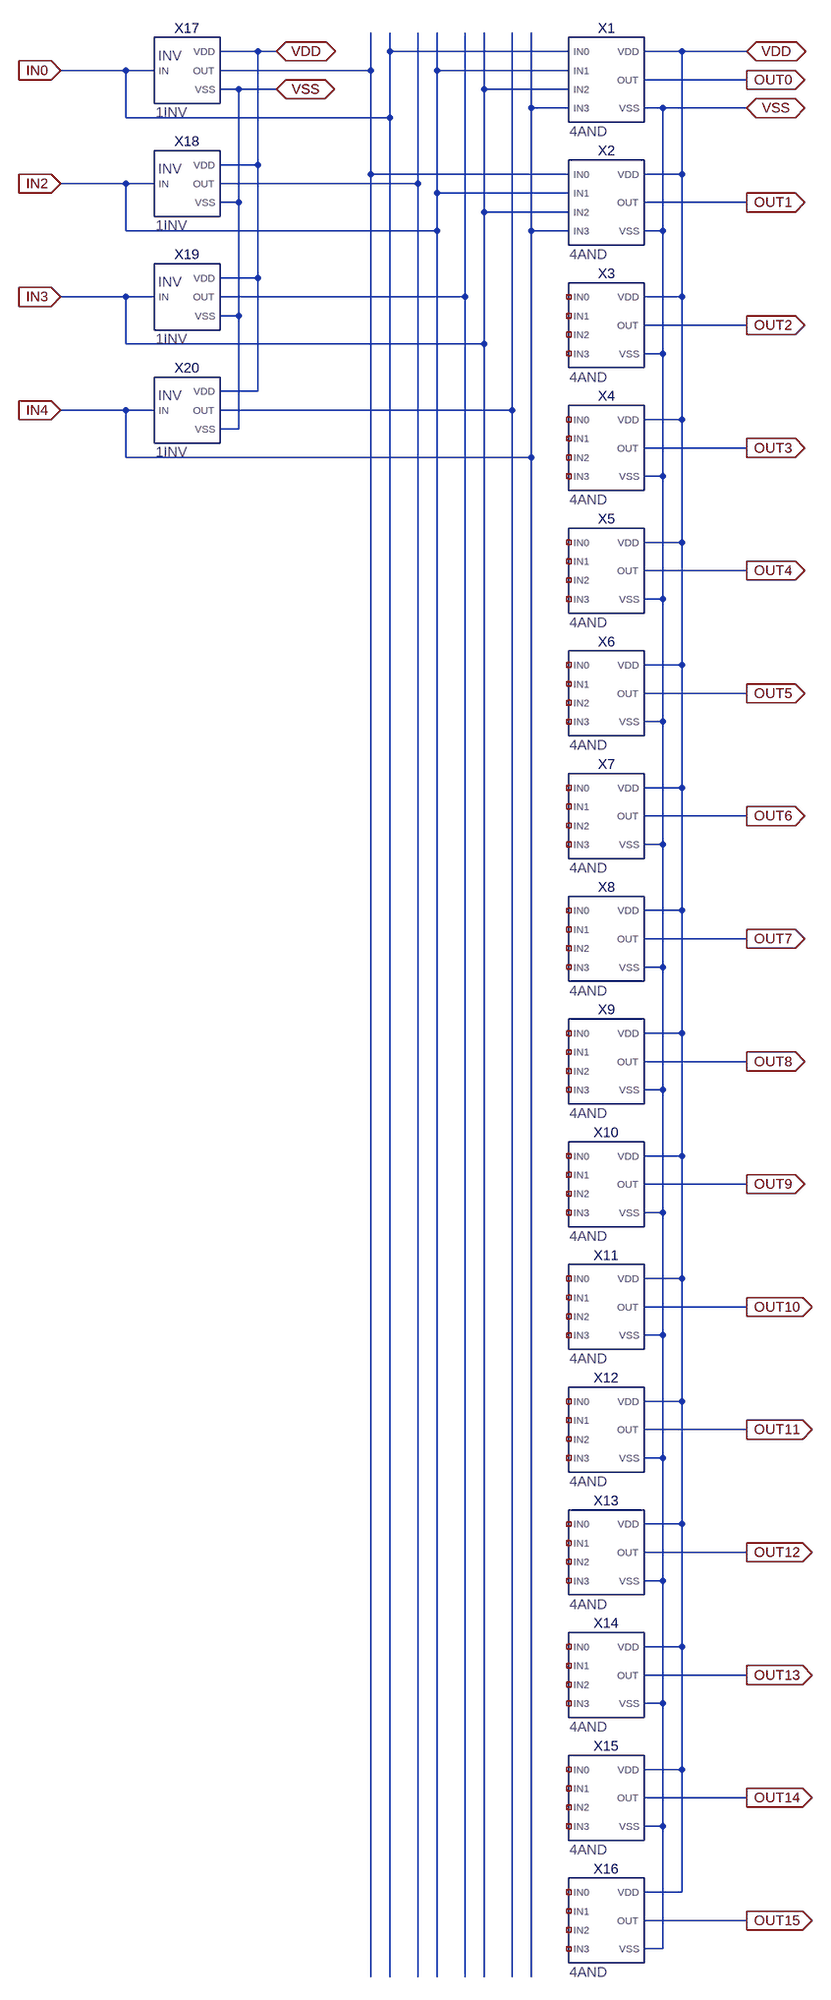
[diagram p0: schematic 4BTO16D.asc]
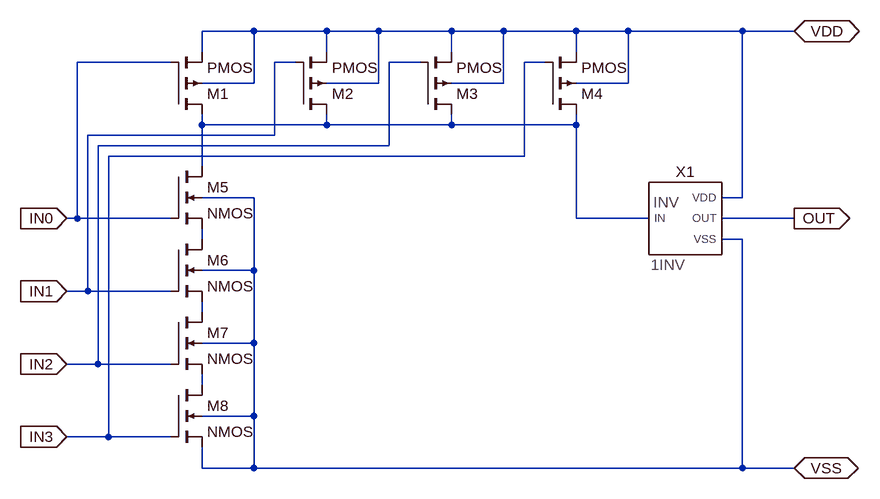
[diagram p1: sub-circuit 4and.asc]
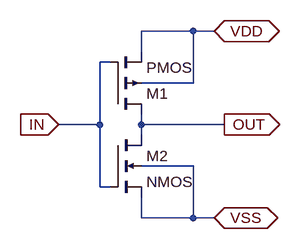
[diagram p2: sub-circuit 1inv.asc]
4BTO16D.asc, the LTspice schematic file:
Version 4
SHEET 1 2456 2760
WIRE 224 -528 160 -528
WIRE 256 -528 224 -528
WIRE 448 -528 448 -560
WIRE 752 -528 448 -528
WIRE 944 -528 880 -528
WIRE 1056 -528 944 -528
WIRE 0 -496 -144 -496
WIRE 48 -496 0 -496
WIRE 416 -496 416 -560
WIRE 416 -496 160 -496
WIRE 528 -496 528 -560
WIRE 752 -496 528 -496
WIRE 1056 -480 880 -480
WIRE 192 -464 160 -464
WIRE 256 -464 192 -464
WIRE 608 -464 608 -560
WIRE 752 -464 608 -464
WIRE 688 -432 688 -560
WIRE 752 -432 688 -432
WIRE 912 -432 880 -432
WIRE 1056 -432 912 -432
WIRE 0 -416 0 -496
WIRE 448 -416 448 -528
WIRE 448 -416 0 -416
WIRE 224 -336 224 -528
WIRE 224 -336 160 -336
WIRE 416 -320 416 -496
WIRE 752 -320 416 -320
WIRE 944 -320 944 -528
WIRE 944 -320 880 -320
WIRE 0 -304 -144 -304
WIRE 48 -304 0 -304
WIRE 496 -304 496 -560
WIRE 496 -304 160 -304
WIRE 528 -288 528 -496
WIRE 752 -288 528 -288
WIRE 192 -272 192 -464
WIRE 192 -272 160 -272
WIRE 1056 -272 880 -272
WIRE 608 -256 608 -464
WIRE 752 -256 608 -256
WIRE 0 -224 0 -304
WIRE 528 -224 528 -288
WIRE 528 -224 0 -224
WIRE 688 -224 688 -432
WIRE 752 -224 688 -224
WIRE 912 -224 912 -432
WIRE 912 -224 880 -224
WIRE 224 -144 224 -336
WIRE 224 -144 160 -144
WIRE 0 -112 -144 -112
WIRE 48 -112 0 -112
WIRE 576 -112 576 -560
WIRE 576 -112 160 -112
WIRE 944 -112 944 -320
WIRE 944 -112 880 -112
WIRE 192 -80 192 -272
WIRE 192 -80 160 -80
WIRE 1056 -64 880 -64
WIRE 0 -32 0 -112
WIRE 608 -32 608 -256
WIRE 608 -32 0 -32
WIRE 912 -16 912 -224
WIRE 912 -16 880 -16
WIRE 224 48 224 -144
WIRE 224 48 160 48
WIRE 0 80 -144 80
WIRE 48 80 0 80
WIRE 656 80 656 -560
WIRE 656 80 160 80
WIRE 944 96 944 -112
WIRE 944 96 880 96
WIRE 192 112 192 -80
WIRE 192 112 160 112
WIRE 1056 144 880 144
WIRE 0 160 0 80
WIRE 688 160 688 -224
WIRE 688 160 0 160
WIRE 912 192 912 -16
WIRE 912 192 880 192
WIRE 944 304 944 96
WIRE 944 304 880 304
WIRE 1056 352 880 352
WIRE 912 400 912 192
WIRE 912 400 880 400
WIRE 944 512 944 304
WIRE 944 512 880 512
WIRE 1056 560 880 560
WIRE 912 608 912 400
WIRE 912 608 880 608
WIRE 944 720 944 512
WIRE 944 720 880 720
WIRE 1056 768 880 768
WIRE 912 816 912 608
WIRE 912 816 880 816
WIRE 944 928 944 720
WIRE 944 928 880 928
WIRE 1056 976 880 976
WIRE 912 1024 912 816
WIRE 912 1024 880 1024
WIRE 944 1136 944 928
WIRE 944 1136 880 1136
WIRE 1056 1184 880 1184
WIRE 912 1232 912 1024
WIRE 912 1232 880 1232
WIRE 944 1344 944 1136
WIRE 944 1344 880 1344
WIRE 1056 1392 880 1392
WIRE 912 1440 912 1232
WIRE 912 1440 880 1440
WIRE 944 1552 944 1344
WIRE 944 1552 880 1552
WIRE 1056 1600 880 1600
WIRE 912 1648 912 1440
WIRE 912 1648 880 1648
WIRE 944 1760 944 1552
WIRE 944 1760 880 1760
WIRE 1056 1808 880 1808
WIRE 912 1856 912 1648
WIRE 912 1856 880 1856
WIRE 944 1968 944 1760
WIRE 944 1968 880 1968
WIRE 1056 2016 880 2016
WIRE 912 2064 912 1856
WIRE 912 2064 880 2064
WIRE 944 2176 944 1968
WIRE 944 2176 880 2176
WIRE 1056 2224 880 2224
WIRE 912 2272 912 2064
WIRE 912 2272 880 2272
WIRE 944 2384 944 2176
WIRE 944 2384 880 2384
WIRE 1056 2432 880 2432
WIRE 912 2480 912 2272
WIRE 912 2480 880 2480
WIRE 944 2592 944 2384
WIRE 944 2592 880 2592
WIRE 1056 2640 880 2640
WIRE 912 2688 912 2480
WIRE 912 2688 880 2688
WIRE 416 2736 416 -320
WIRE 448 2736 448 -416
WIRE 496 2736 496 -304
WIRE 528 2736 528 -224
WIRE 576 2736 576 -112
WIRE 608 2736 608 -32
WIRE 656 2736 656 80
WIRE 688 2736 688 160
FLAG -144 -496 IN0
IOPIN -144 -496 In
FLAG -144 -304 IN2
IOPIN -144 -304 In
FLAG -144 -112 IN3
IOPIN -144 -112 In
FLAG -144 80 IN4
IOPIN -144 80 In
FLAG 1056 -480 OUT0
IOPIN 1056 -480 Out
FLAG 1056 -272 OUT1
IOPIN 1056 -272 Out
FLAG 1056 -64 OUT2
IOPIN 1056 -64 Out
FLAG 1056 144 OUT3
IOPIN 1056 144 Out
FLAG 1056 352 OUT4
IOPIN 1056 352 Out
FLAG 1056 560 OUT5
IOPIN 1056 560 Out
FLAG 1056 768 OUT6
IOPIN 1056 768 Out
FLAG 1056 976 OUT7
IOPIN 1056 976 Out
FLAG 1056 1184 OUT8
IOPIN 1056 1184 Out
FLAG 1056 1392 OUT9
IOPIN 1056 1392 Out
FLAG 1056 1600 OUT10
IOPIN 1056 1600 Out
FLAG 1056 2016 OUT12
IOPIN 1056 2016 Out
FLAG 1056 2224 OUT13
IOPIN 1056 2224 Out
FLAG 1056 2432 OUT14
IOPIN 1056 2432 Out
FLAG 1056 2640 OUT15
IOPIN 1056 2640 Out
FLAG 1056 1808 OUT11
IOPIN 1056 1808 Out
FLAG 256 -464 VSS
IOPIN 256 -464 BiDir
FLAG 256 -528 VDD
IOPIN 256 -528 BiDir
FLAG 1056 -528 VDD
IOPIN 1056 -528 BiDir
FLAG 1056 -432 VSS
IOPIN 1056 -432 BiDir
SYMBOL 4AND 816 -480 R0
SYMATTR InstName X1
SYMBOL 4AND 816 -272 R0
SYMATTR InstName X2
SYMBOL 4AND 816 -64 R0
SYMATTR InstName X3
SYMBOL 4AND 816 144 R0
SYMATTR InstName X4
SYMBOL 4AND 816 352 R0
SYMATTR InstName X5
SYMBOL 4AND 816 560 R0
SYMATTR InstName X6
SYMBOL 4AND 816 768 R0
SYMATTR InstName X7
SYMBOL 4AND 816 976 R0
SYMATTR InstName X8
SYMBOL 4AND 816 1184 R0
SYMATTR InstName X9
SYMBOL 4AND 816 1392 R0
SYMATTR InstName X10
SYMBOL 4AND 816 1600 R0
SYMATTR InstName X11
SYMBOL 4AND 816 1808 R0
SYMATTR InstName X12
SYMBOL 4AND 816 2016 R0
SYMATTR InstName X13
SYMBOL 4AND 816 2224 R0
SYMATTR InstName X14
SYMBOL 4AND 816 2432 R0
SYMATTR InstName X15
SYMBOL 4AND 816 2640 R0
SYMATTR InstName X16
SYMBOL 1INV 96 -496 R0
SYMATTR InstName X17
SYMBOL 1INV 96 -304 R0
SYMATTR InstName X18
SYMBOL 1INV 96 -112 R0
SYMATTR InstName X19
SYMBOL 1INV 96 80 R0
SYMATTR InstName X20

4and.asc, the sub-circuit schematic file:
Version 4
SHEET 1 880 680
WIRE -96 -224 -176 -224
WIRE 16 -224 -96 -224
WIRE 96 -224 16 -224
WIRE 208 -224 96 -224
WIRE 288 -224 208 -224
WIRE 400 -224 288 -224
WIRE 480 -224 400 -224
WIRE 656 -224 480 -224
WIRE 736 -224 656 -224
WIRE -176 -192 -176 -224
WIRE 16 -192 16 -224
WIRE 208 -192 208 -224
WIRE 400 -192 400 -224
WIRE -224 -176 -368 -176
WIRE -32 -176 -64 -176
WIRE 160 -176 112 -176
WIRE 352 -176 320 -176
WIRE -96 -144 -96 -224
WIRE -96 -144 -176 -144
WIRE 96 -144 96 -224
WIRE 96 -144 16 -144
WIRE 288 -144 288 -224
WIRE 288 -144 208 -144
WIRE 480 -144 480 -224
WIRE 480 -144 400 -144
WIRE -176 -80 -176 -96
WIRE 16 -80 16 -96
WIRE 16 -80 -176 -80
WIRE 208 -80 208 -96
WIRE 208 -80 16 -80
WIRE 400 -80 400 -96
WIRE 400 -80 208 -80
WIRE -64 -64 -64 -176
WIRE -64 -64 -352 -64
WIRE 112 -48 112 -176
WIRE 112 -48 -336 -48
WIRE 320 -32 320 -176
WIRE 320 -32 -320 -32
WIRE -176 -16 -176 -80
WIRE -96 32 -176 32
WIRE 656 32 656 -224
WIRE 656 32 624 32
WIRE -368 64 -368 -176
WIRE -368 64 -384 64
WIRE -224 64 -368 64
WIRE 400 64 400 -80
WIRE 512 64 400 64
WIRE 736 64 624 64
WIRE -176 96 -176 80
WIRE 656 96 624 96
WIRE -96 144 -96 32
WIRE -96 144 -176 144
WIRE -352 176 -352 -64
WIRE -352 176 -384 176
WIRE -224 176 -352 176
WIRE -176 208 -176 192
WIRE -96 256 -96 144
WIRE -96 256 -176 256
WIRE -336 288 -336 -48
WIRE -336 288 -384 288
WIRE -224 288 -336 288
WIRE -176 320 -176 304
WIRE -96 368 -96 256
WIRE -96 368 -176 368
WIRE -320 400 -320 -32
WIRE -320 400 -384 400
WIRE -224 400 -320 400
WIRE -176 448 -176 416
WIRE -96 448 -96 368
WIRE -96 448 -176 448
WIRE 656 448 656 96
WIRE 656 448 -96 448
WIRE 736 448 656 448
FLAG 736 64 OUT
IOPIN 736 64 Out
FLAG 736 -224 VDD
IOPIN 736 -224 BiDir
FLAG 736 448 VSS
IOPIN 736 448 BiDir
FLAG -384 64 IN0
IOPIN -384 64 In
FLAG -384 176 IN1
IOPIN -384 176 In
FLAG -384 288 IN2
IOPIN -384 288 In
FLAG -384 400 IN3
IOPIN -384 400 In
SYMBOL nmos4 -224 96 R0
SYMATTR InstName M6
SYMATTR Value2 l=110n w=180n
SYMBOL nmos4 -224 -16 R0
SYMATTR InstName M5
SYMATTR Value2 l=110n w=180n
SYMBOL pmos4 -224 -96 M180
SYMATTR InstName M1
SYMATTR Value2 l=110n w=180n
SYMBOL pmos4 352 -96 M180
SYMATTR InstName M4
SYMATTR Value2 l=110n w=180n
SYMBOL 1INV 560 64 R0
SYMATTR InstName X1
SYMBOL nmos4 -224 208 R0
SYMATTR InstName M7
SYMATTR Value2 l=110n w=180n
SYMBOL nmos4 -224 320 R0
SYMATTR InstName M8
SYMATTR Value2 l=110n w=180n
SYMBOL pmos4 -32 -96 M180
SYMATTR InstName M2
SYMATTR Value2 l=110n w=180n
SYMBOL pmos4 160 -96 M180
SYMATTR InstName M3
SYMATTR Value2 l=110n w=180n

1inv.asc, the sub-circuit schematic file:
Version 4
SHEET 1 880 680
WIRE 224 -16 144 -16
WIRE 256 -16 224 -16
WIRE 144 16 144 -16
WIRE 96 32 80 32
WIRE 224 64 224 -16
WIRE 224 64 144 64
WIRE 80 128 80 32
WIRE 80 128 16 128
WIRE 144 128 144 112
WIRE 272 128 144 128
WIRE 144 144 144 128
WIRE 224 192 144 192
WIRE 80 224 80 128
WIRE 96 224 80 224
WIRE 144 272 144 240
WIRE 224 272 224 192
WIRE 224 272 144 272
WIRE 256 272 224 272
FLAG 16 128 IN
IOPIN 16 128 In
FLAG 272 128 OUT
IOPIN 272 128 Out
FLAG 256 -16 VDD
IOPIN 256 -16 BiDir
FLAG 256 272 VSS
IOPIN 256 272 BiDir
SYMBOL pmos4 96 112 M180
SYMATTR InstName M1
SYMATTR Value2 l=110nM w=180nM
SYMBOL nmos4 96 144 R0
SYMATTR InstName M2
SYMATTR Value2 l=110nM w=180nM

The netlist it stands for:
* 4BTO16D.asc
XX1 IN0 IN2 IN3 IN4 OUT0 VDD VSS 4and
XX2 N001 IN2 IN3 IN4 OUT1 VDD VSS 4and
XX3 NC_01 NC_02 NC_03 NC_04 OUT2 VDD VSS 4and
XX4 NC_05 NC_06 NC_07 NC_08 OUT3 VDD VSS 4and
XX5 NC_09 NC_10 NC_11 NC_12 OUT4 VDD VSS 4and
XX6 NC_13 NC_14 NC_15 NC_16 OUT5 VDD VSS 4and
XX7 NC_17 NC_18 NC_19 NC_20 OUT6 VDD VSS 4and
XX8 NC_21 NC_22 NC_23 NC_24 OUT7 VDD VSS 4and
XX9 NC_25 NC_26 NC_27 NC_28 OUT8 VDD VSS 4and
XX10 NC_29 NC_30 NC_31 NC_32 OUT9 VDD VSS 4and
XX11 NC_33 NC_34 NC_35 NC_36 OUT10 VDD VSS 4and
XX12 NC_37 NC_38 NC_39 NC_40 OUT11 VDD VSS 4and
XX13 NC_41 NC_42 NC_43 NC_44 OUT12 VDD VSS 4and
XX14 NC_45 NC_46 NC_47 NC_48 OUT13 VDD VSS 4and
XX15 NC_49 NC_50 NC_51 NC_52 OUT14 VDD VSS 4and
XX16 NC_53 NC_54 NC_55 NC_56 OUT15 VDD VSS 4and
XX17 IN0 N001 VDD VSS 1inv
XX18 IN2 N002 VDD VSS 1inv
XX19 IN3 N003 VDD VSS 1inv
XX20 IN4 N004 VDD VSS 1inv

* block symbol definitions
.subckt 4and IN0 IN1 IN2 IN3 OUT VDD VSS
M6 N002 IN1 N003 VSS NMOS l=110n w=180n
M5 N001 IN0 N002 VSS NMOS l=110n w=180n
M1 N001 IN0 VDD VDD PMOS l=110n w=180n
M4 N001 IN3 VDD VDD PMOS l=110n w=180n
XX1 N001 OUT VDD VSS 1inv
M7 N003 IN2 N004 VSS NMOS l=110n w=180n
M8 N004 IN3 VSS VSS NMOS l=110n w=180n
M2 N001 IN1 VDD VDD PMOS l=110n w=180n
M3 N001 IN2 VDD VDD PMOS l=110n w=180n
.ends 4and

.subckt 1inv IN OUT VDD VSS
M1 OUT IN VDD VDD PMOS l=110nM w=180nM
M2 OUT IN VSS VSS NMOS l=110nM w=180nM
.ends 1inv

.model NMOS NMOS
.model PMOS PMOS
.lib standard.mos
.backanno
.end